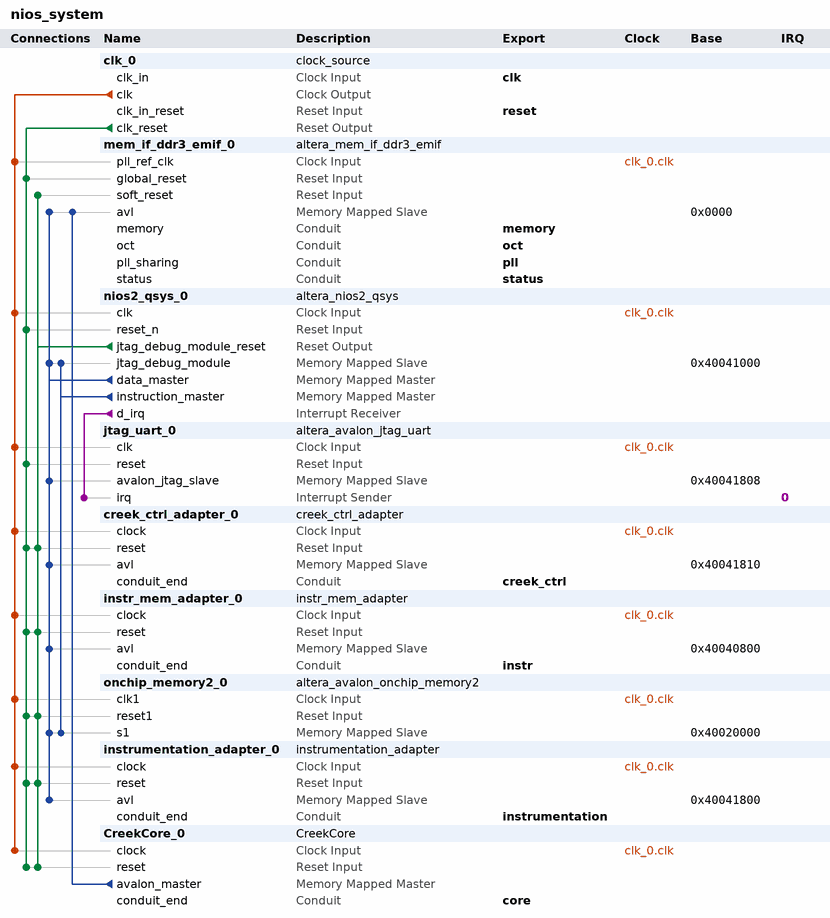
[diagram p0: system contents]
# Platform Designer (Qsys) system nios_system, Cyclone V 5CSXFC6D6F31C8ES
# Parameters at their usual value, and those the tool derives, are not listed.
package require -exact qsys 13.1
create_system nios_system
set_project_property DEVICE_FAMILY {Cyclone V}
set_project_property DEVICE 5CSXFC6D6F31C8ES

add_instance clk_0 clock_source 13.1
set_instance_parameter_value clk_0 clockFrequency 50000000

add_instance mem_if_ddr3_emif_0 altera_mem_if_ddr3_emif 13.1
set_instance_parameter_value mem_if_ddr3_emif_0 MEM_VENDOR JEDEC
set_instance_parameter_value mem_if_ddr3_emif_0 MEM_FORMAT DISCRETE
set_instance_parameter_value mem_if_ddr3_emif_0 MEM_CLK_FREQ_MAX 400.0
set_instance_parameter_value mem_if_ddr3_emif_0 MEM_ROW_ADDR_WIDTH 15
set_instance_parameter_value mem_if_ddr3_emif_0 MEM_COL_ADDR_WIDTH 10
set_instance_parameter_value mem_if_ddr3_emif_0 MEM_DQ_WIDTH 32
set_instance_parameter_value mem_if_ddr3_emif_0 MEM_BANKADDR_WIDTH 3
set_instance_parameter_value mem_if_ddr3_emif_0 MEM_DRV_STR RZQ/6
set_instance_parameter_value mem_if_ddr3_emif_0 MEM_RTT_WR {Dynamic ODT off}
set_instance_parameter_value mem_if_ddr3_emif_0 MEM_WTCL 6
set_instance_parameter_value mem_if_ddr3_emif_0 MEM_TCL 7
set_instance_parameter_value mem_if_ddr3_emif_0 TIMING_TIS 175
set_instance_parameter_value mem_if_ddr3_emif_0 TIMING_TIH 250
set_instance_parameter_value mem_if_ddr3_emif_0 TIMING_TDS 50
set_instance_parameter_value mem_if_ddr3_emif_0 TIMING_TDH 125
set_instance_parameter_value mem_if_ddr3_emif_0 TIMING_TDQSQ 120
set_instance_parameter_value mem_if_ddr3_emif_0 TIMING_TDQSCK 400
set_instance_parameter_value mem_if_ddr3_emif_0 TIMING_TDQSS 0.25
set_instance_parameter_value mem_if_ddr3_emif_0 TIMING_TQSH 0.38
set_instance_parameter_value mem_if_ddr3_emif_0 TIMING_TDSH 0.2
set_instance_parameter_value mem_if_ddr3_emif_0 TIMING_TDSS 0.2
set_instance_parameter_value mem_if_ddr3_emif_0 MEM_TINIT_US 499
set_instance_parameter_value mem_if_ddr3_emif_0 MEM_TMRD_CK 3
set_instance_parameter_value mem_if_ddr3_emif_0 MEM_TRAS_NS 40.0
set_instance_parameter_value mem_if_ddr3_emif_0 MEM_TRCD_NS 15.0
set_instance_parameter_value mem_if_ddr3_emif_0 MEM_TRP_NS 15.0
set_instance_parameter_value mem_if_ddr3_emif_0 MEM_TREFI_US 7.0
set_instance_parameter_value mem_if_ddr3_emif_0 MEM_TRFC_NS 75.0
set_instance_parameter_value mem_if_ddr3_emif_0 MEM_TWTR 2
set_instance_parameter_value mem_if_ddr3_emif_0 MEM_TFAW_NS 37.5
set_instance_parameter_value mem_if_ddr3_emif_0 MEM_TRRD_NS 7.5
set_instance_parameter_value mem_if_ddr3_emif_0 MEM_TRTP_NS 7.5
set_instance_parameter_value mem_if_ddr3_emif_0 RATE Half
set_instance_parameter_value mem_if_ddr3_emif_0 MEM_CLK_FREQ 300.0
set_instance_parameter_value mem_if_ddr3_emif_0 SPEED_GRADE 8
set_instance_parameter_value mem_if_ddr3_emif_0 HARD_EMIF false
set_instance_parameter_value mem_if_ddr3_emif_0 POWER_OF_TWO_BUS false
set_instance_parameter_value mem_if_ddr3_emif_0 AVL_MAX_SIZE 4
set_instance_parameter_value mem_if_ddr3_emif_0 PRIORITY_PORT 1,1,1,1,1,1
set_instance_parameter_value mem_if_ddr3_emif_0 CPORT_TYPE_PORT Bidirectional,Bidirectional,Bidirectional,Bidirectional,Bidirectional,Bidirectional
set_instance_parameter_value mem_if_ddr3_emif_0 REF_CLK_FREQ 125.0
set_instance_parameter_value mem_if_ddr3_emif_0 DEFAULT_FAST_SIM_MODEL true
set_instance_parameter_value mem_if_ddr3_emif_0 EXPORT_AFI_HALF_CLK false
set_instance_parameter_value mem_if_ddr3_emif_0 PLL_LOCATION Top_Bottom
set_instance_parameter_value mem_if_ddr3_emif_0 CALIBRATION_MODE Skip
set_instance_parameter_value mem_if_ddr3_emif_0 USER_DEBUG_LEVEL 1
set_instance_parameter_value mem_if_ddr3_emif_0 TIMING_BOARD_MAX_CK_DELAY 0.6
set_instance_parameter_value mem_if_ddr3_emif_0 TIMING_BOARD_MAX_DQS_DELAY 0.6
set_instance_parameter_value mem_if_ddr3_emif_0 TIMING_BOARD_SKEW_CKDQS_DIMM_MIN -0.01
set_instance_parameter_value mem_if_ddr3_emif_0 TIMING_BOARD_SKEW_CKDQS_DIMM_MAX 0.01
set_instance_parameter_value mem_if_ddr3_emif_0 TIMING_BOARD_SKEW_WITHIN_DQS 0.02
set_instance_parameter_value mem_if_ddr3_emif_0 TIMING_BOARD_SKEW_BETWEEN_DQS 0.02
set_instance_parameter_value mem_if_ddr3_emif_0 TIMING_BOARD_DQ_TO_DQS_SKEW 0.0
set_instance_parameter_value mem_if_ddr3_emif_0 TIMING_BOARD_AC_SKEW 0.02
set_instance_parameter_value mem_if_ddr3_emif_0 TIMING_BOARD_AC_TO_CK_SKEW 0.0

add_instance nios2_qsys_0 altera_nios2_qsys 13.1
set_instance_parameter_value nios2_qsys_0 resetSlave onchip_memory2_0.s1
set_instance_parameter_value nios2_qsys_0 mmu_TLBMissExcSlave None
set_instance_parameter_value nios2_qsys_0 exceptionSlave onchip_memory2_0.s1
set_instance_parameter_value nios2_qsys_0 breakSlave nios2_qsys_0.jtag_debug_module
set_instance_parameter_value nios2_qsys_0 impl Tiny
set_instance_parameter_value nios2_qsys_0 icache_size 4096

add_instance jtag_uart_0 altera_avalon_jtag_uart 13.1
set_instance_parameter_value jtag_uart_0 simInteractiveOptions NO_INTERACTIVE_WINDOWS

add_instance creek_ctrl_adapter_0 creek_ctrl_adapter 1.0

add_instance instr_mem_adapter_0 instr_mem_adapter 1.0

add_instance onchip_memory2_0 altera_avalon_onchip_memory2 13.1
set_instance_parameter_value onchip_memory2_0 dataWidth 32
set_instance_parameter_value onchip_memory2_0 dualPort false
set_instance_parameter_value onchip_memory2_0 initMemContent false
set_instance_parameter_value onchip_memory2_0 initializationFileName onchip_mem.hex
set_instance_parameter_value onchip_memory2_0 memorySize 128000

add_instance instrumentation_adapter_0 instrumentation_adapter 1.0

add_instance CreekCore_0 CreekCore 1.0

# connections
add_connection clk_0.clk creek_ctrl_adapter_0.clock clock
add_connection clk_0.clk CreekCore_0.clock clock
add_connection clk_0.clk instr_mem_adapter_0.clock clock
add_connection clk_0.clk instrumentation_adapter_0.clock clock
add_connection clk_0.clk jtag_uart_0.clk clock
add_connection clk_0.clk mem_if_ddr3_emif_0.pll_ref_clk clock
add_connection clk_0.clk nios2_qsys_0.clk clock
add_connection clk_0.clk onchip_memory2_0.clk1 clock
add_connection clk_0.clk_reset creek_ctrl_adapter_0.reset reset
add_connection clk_0.clk_reset CreekCore_0.reset reset
add_connection clk_0.clk_reset instr_mem_adapter_0.reset reset
add_connection clk_0.clk_reset instrumentation_adapter_0.reset reset
add_connection clk_0.clk_reset jtag_uart_0.reset reset
add_connection clk_0.clk_reset mem_if_ddr3_emif_0.global_reset reset
add_connection clk_0.clk_reset nios2_qsys_0.reset_n reset
add_connection clk_0.clk_reset onchip_memory2_0.reset1 reset
add_connection nios2_qsys_0.jtag_debug_module_reset creek_ctrl_adapter_0.reset reset
add_connection nios2_qsys_0.jtag_debug_module_reset CreekCore_0.reset reset
add_connection nios2_qsys_0.jtag_debug_module_reset instr_mem_adapter_0.reset reset
add_connection nios2_qsys_0.jtag_debug_module_reset instrumentation_adapter_0.reset reset
add_connection nios2_qsys_0.jtag_debug_module_reset mem_if_ddr3_emif_0.soft_reset reset
add_connection nios2_qsys_0.jtag_debug_module_reset onchip_memory2_0.reset1 reset
add_connection CreekCore_0.avalon_master mem_if_ddr3_emif_0.avl avalon
set_connection_parameter_value CreekCore_0.avalon_master/mem_if_ddr3_emif_0.avl baseAddress 0x0000
add_connection nios2_qsys_0.data_master creek_ctrl_adapter_0.avl avalon
set_connection_parameter_value nios2_qsys_0.data_master/creek_ctrl_adapter_0.avl baseAddress 0x40041810
add_connection nios2_qsys_0.data_master instr_mem_adapter_0.avl avalon
set_connection_parameter_value nios2_qsys_0.data_master/instr_mem_adapter_0.avl baseAddress 0x40040800
add_connection nios2_qsys_0.data_master instrumentation_adapter_0.avl avalon
set_connection_parameter_value nios2_qsys_0.data_master/instrumentation_adapter_0.avl baseAddress 0x40041800
add_connection nios2_qsys_0.data_master jtag_uart_0.avalon_jtag_slave avalon
set_connection_parameter_value nios2_qsys_0.data_master/jtag_uart_0.avalon_jtag_slave baseAddress 0x40041808
add_connection nios2_qsys_0.data_master mem_if_ddr3_emif_0.avl avalon
set_connection_parameter_value nios2_qsys_0.data_master/mem_if_ddr3_emif_0.avl baseAddress 0x0000
add_connection nios2_qsys_0.data_master nios2_qsys_0.jtag_debug_module avalon
set_connection_parameter_value nios2_qsys_0.data_master/nios2_qsys_0.jtag_debug_module baseAddress 0x40041000
add_connection nios2_qsys_0.data_master onchip_memory2_0.s1 avalon
set_connection_parameter_value nios2_qsys_0.data_master/onchip_memory2_0.s1 baseAddress 0x40020000
add_connection nios2_qsys_0.instruction_master nios2_qsys_0.jtag_debug_module avalon
set_connection_parameter_value nios2_qsys_0.instruction_master/nios2_qsys_0.jtag_debug_module baseAddress 0x40041000
add_connection nios2_qsys_0.instruction_master onchip_memory2_0.s1 avalon
set_connection_parameter_value nios2_qsys_0.instruction_master/onchip_memory2_0.s1 baseAddress 0x40020000
add_connection nios2_qsys_0.d_irq jtag_uart_0.irq interrupt
set_connection_parameter_value nios2_qsys_0.d_irq/jtag_uart_0.irq irqNumber 0

# exported interfaces
add_interface clk clock sink
set_interface_property clk EXPORT_OF clk_0.clk_in
add_interface reset reset sink
set_interface_property reset EXPORT_OF clk_0.clk_in_reset
add_interface memory conduit end
set_interface_property memory EXPORT_OF mem_if_ddr3_emif_0.memory
add_interface oct conduit end
set_interface_property oct EXPORT_OF mem_if_ddr3_emif_0.oct
add_interface instr conduit end
set_interface_property instr EXPORT_OF instr_mem_adapter_0.conduit_end
add_interface creek_ctrl conduit end
set_interface_property creek_ctrl EXPORT_OF creek_ctrl_adapter_0.conduit_end
add_interface pll conduit end
set_interface_property pll EXPORT_OF mem_if_ddr3_emif_0.pll_sharing
add_interface status conduit end
set_interface_property status EXPORT_OF mem_if_ddr3_emif_0.status
add_interface instrumentation conduit end
set_interface_property instrumentation EXPORT_OF instrumentation_adapter_0.conduit_end
add_interface core conduit end
set_interface_property core EXPORT_OF CreekCore_0.conduit_end

set_interconnect_requirement {$system} qsys_mm.clockCrossingAdapter HANDSHAKE
set_interconnect_requirement {$system} qsys_mm.maxAdditionalLatency 1
set_interconnect_requirement {$system} qsys_mm.insertDefaultSlave false

save_system nios_system.qsys
